# Altium schematic sheet PID.SchDoc: Constant tuning PID
size A2; Author: M.Beldyga; CompanyName: WUT ISE; DrawnBy: M.Beldyga; Organization: WUT ISE; Address1: PW ISE; Address2: Nowowiejska 15/19 00-665 Warsaw; Address3: micbeldyga@gmail.com; SheetNumber: 2; SheetTotal: 12; ModifiedBy: -; CheckedDate: -; DivGrp: WUT ISE; Designer: M.Beldyga; ModifiedDate: -; ProjectName: Sensor Box
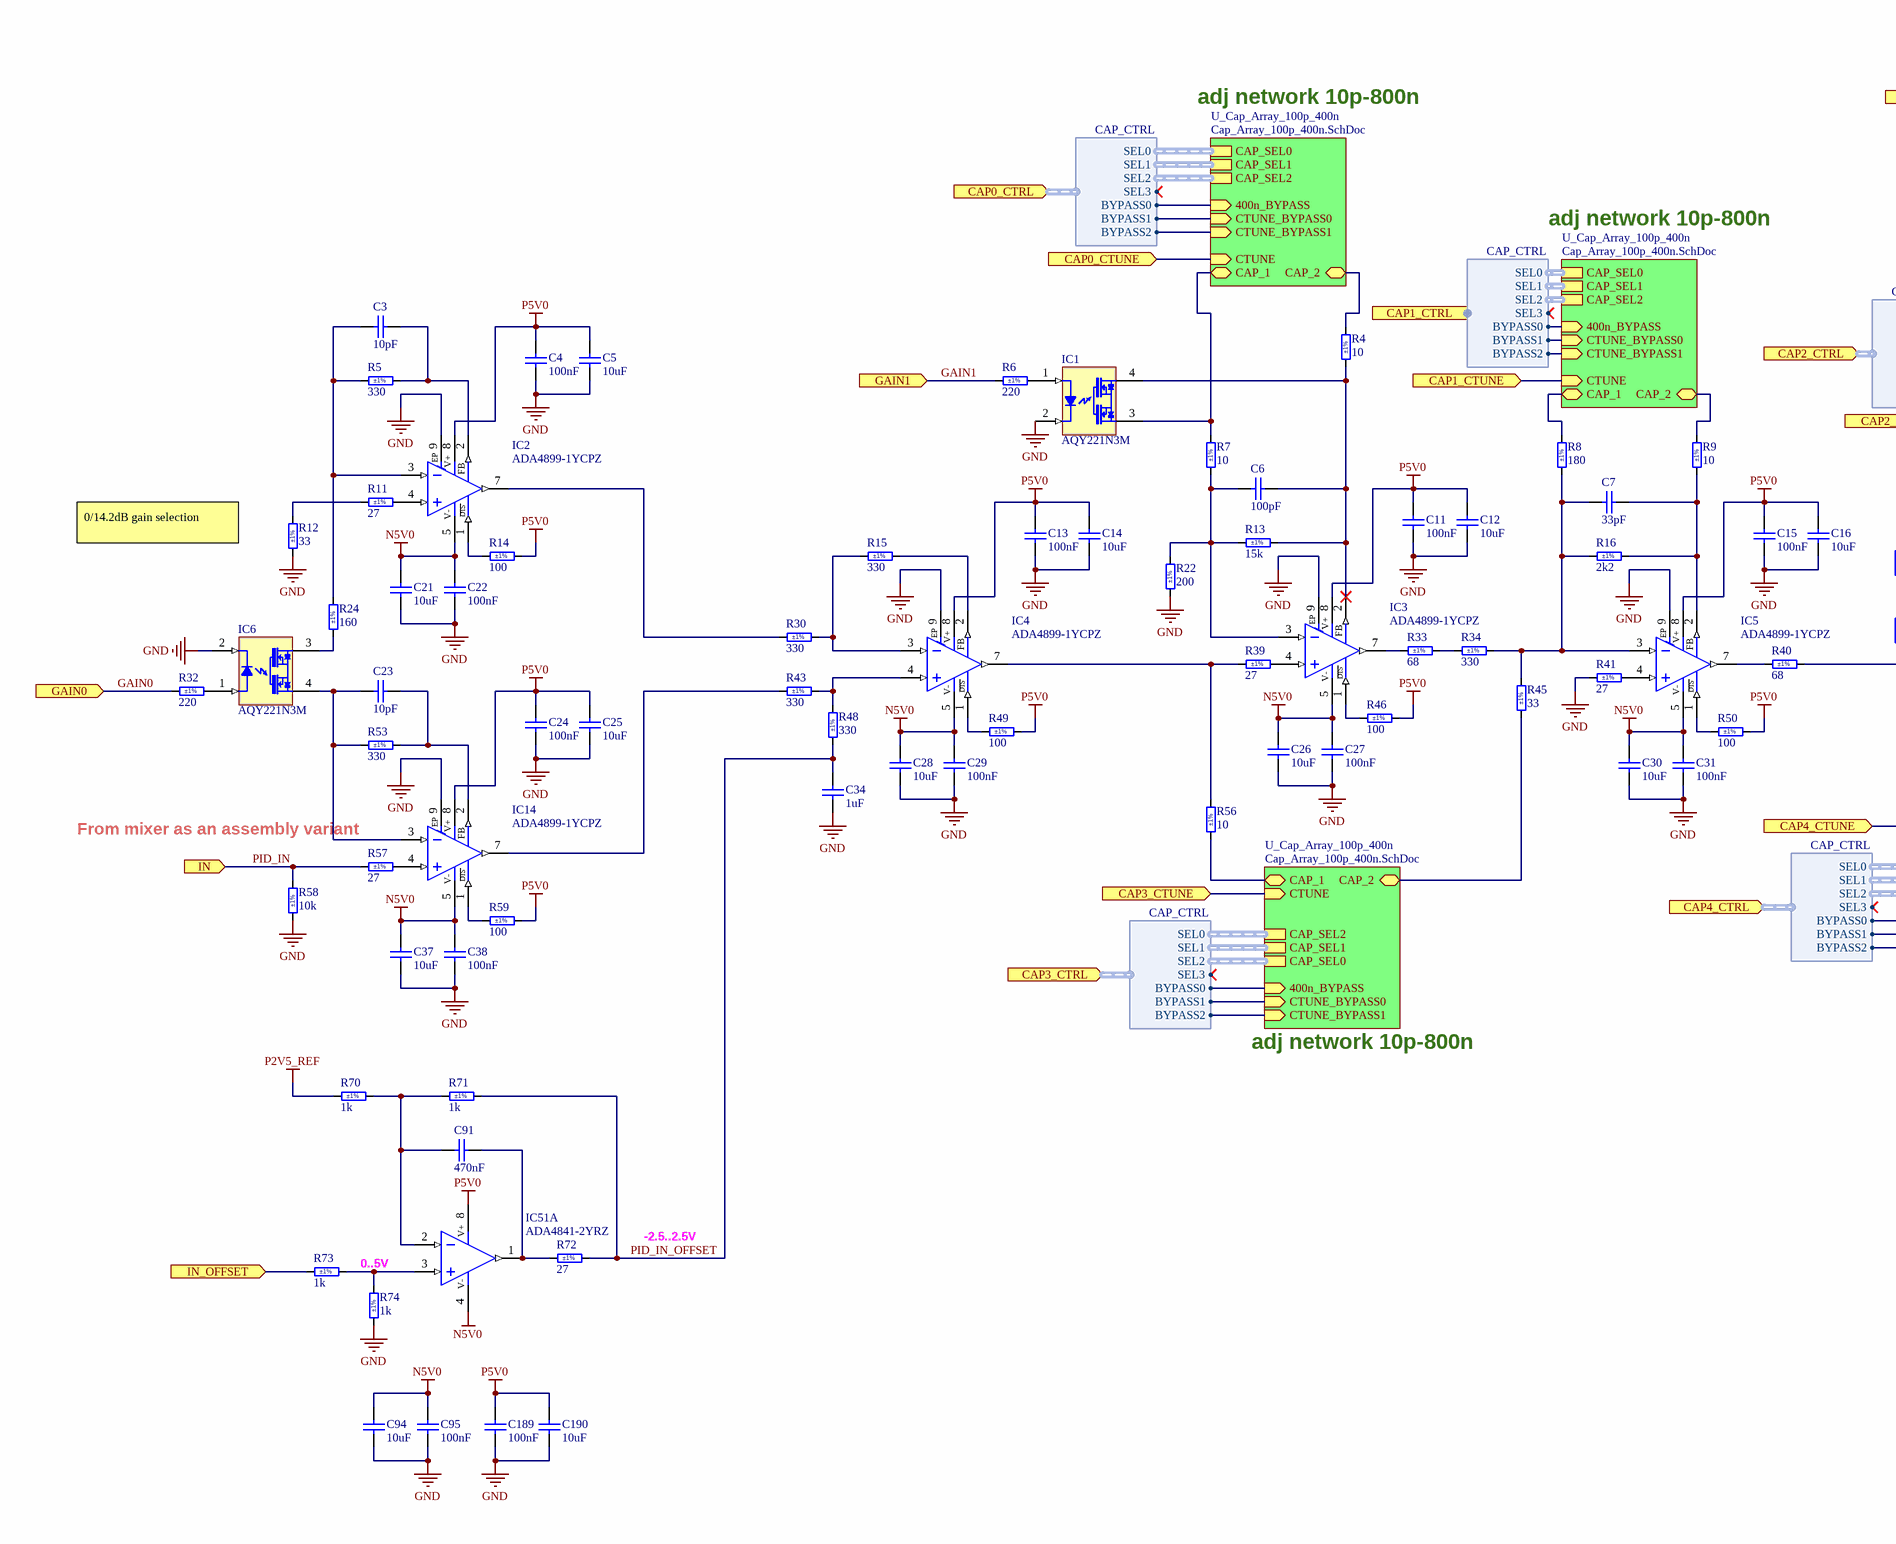
[diagram p0: PID.SchDoc, left]
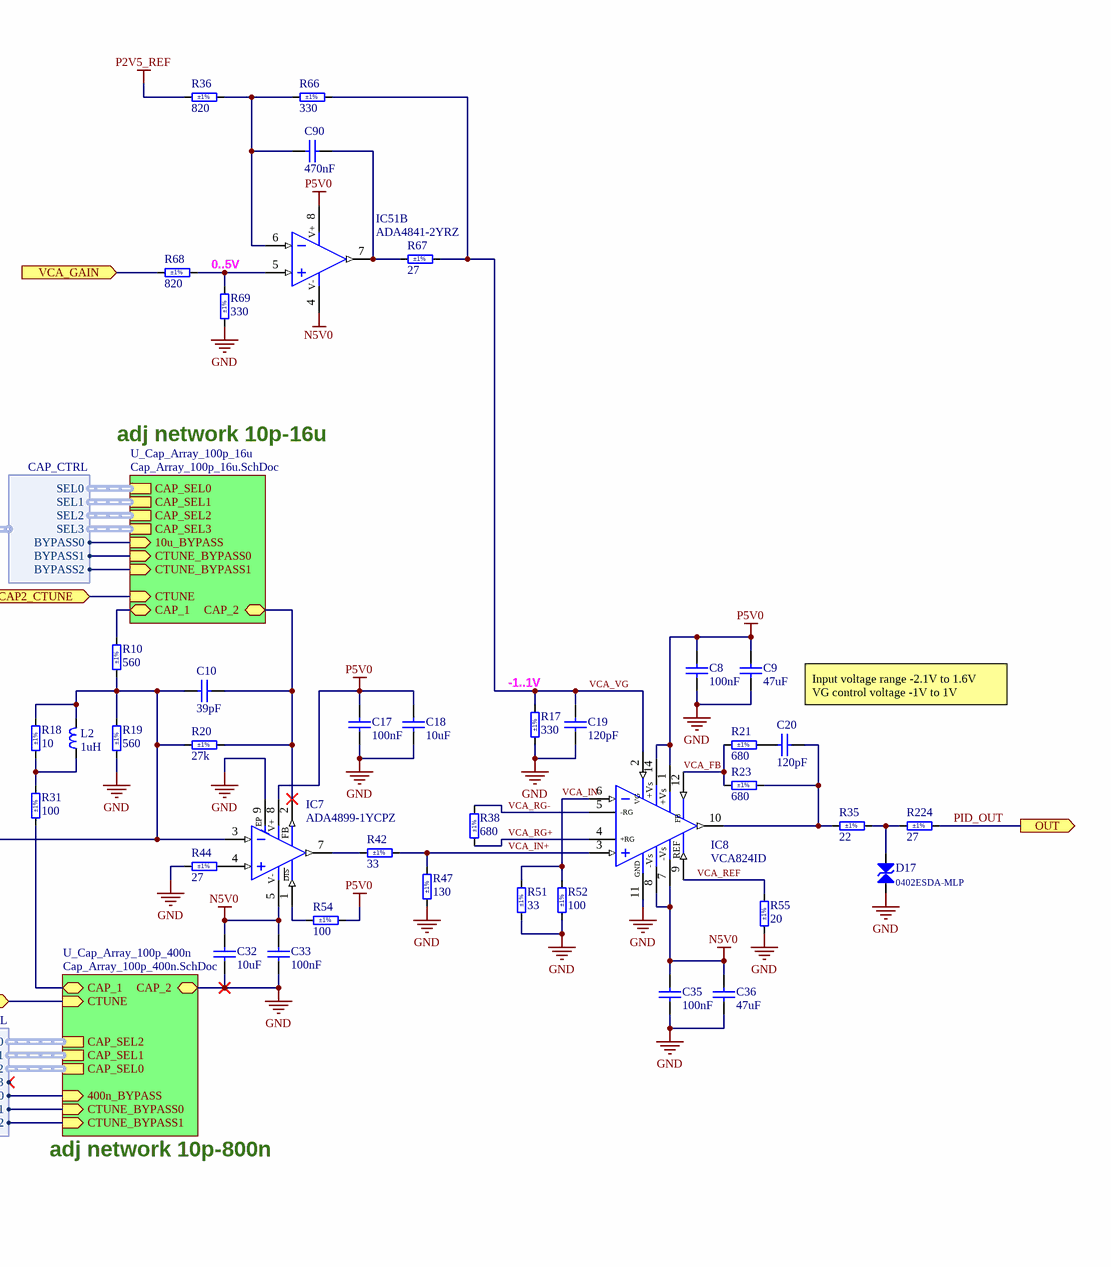
[diagram p1: PID.SchDoc, right]

## Parts
C3  10pF  [CAPC1005X55N]
C4  100nF  [CAPC1005X55N]
C5  10uF  [CAPC2012X95N]
C6  100pF  [CAPC1005X55N]
C7  33pF  [CAPC1005X55N]
C8  100nF  [CAPC1005X55N]
C9  47uF  [CAPC3216X180N]
C10  39pF  [CAPC1005X55N]
C11  100nF  [CAPC1005X55N]
C12  10uF  [CAPC2012X95N]
C13  100nF  [CAPC1005X55N]
C14  10uF  [CAPC2012X95N]
C15  100nF  [CAPC1005X55N]
C16  10uF  [CAPC2012X95N]
C17  100nF  [CAPC1005X55N]
C18  10uF  [CAPC2012X95N]
C19  120pF  [CAPC1005X55N]
C20  120pF  [CAPC1005X55N]
C21  10uF  [CAPC2012X95N]
C22  100nF  [CAPC1005X55N]
C23  10pF  [CAPC1005X55N]
C24  100nF  [CAPC1005X55N]
C25  10uF  [CAPC2012X95N]
C26  10uF  [CAPC2012X95N]
C27  100nF  [CAPC1005X55N]
C28  10uF  [CAPC2012X95N]
C29  100nF  [CAPC1005X55N]
C30  10uF  [CAPC2012X95N]
C31  100nF  [CAPC1005X55N]
C32  10uF  [CAPC2012X95N]
C33  100nF  [CAPC1005X55N]
C34  1uF  [CAPC1005X55N]
C35  100nF  [CAPC1005X55N]
C36  47uF  [CAPC3216X180N]
C37  10uF  [CAPC2012X95N]
C38  100nF  [CAPC1005X55N]
C90  470nF  [CAPC1005X55N]
C91  470nF  [CAPC1005X55N]
C94  10uF  [CAPC2012X95N]
C95  100nF  [CAPC1005X55N]
C189  100nF  [CAPC1005X55N]
C190  10uF  [CAPC2012X95N]
D17  0402ESDA-MLP  [EATON_0402ESDA-MLP]
IC1  AQY221N3M  [PANASONIC_AQY22(SON)]
IC2  ADA4899-1YCPZ  [SON50P300X300X90-9N-R160X189]
IC3  ADA4899-1YCPZ  [SON50P300X300X90-9N-R160X189]
IC4  ADA4899-1YCPZ  [SON50P300X300X90-9N-R160X189]
IC5  ADA4899-1YCPZ  [SON50P300X300X90-9N-R160X189]
IC6  AQY221N3M  [PANASONIC_AQY22(SON)]
IC7  ADA4899-1YCPZ  [SON50P300X300X90-9N-R160X189]
IC8  VCA824ID  [SOIC127P600X175-14N]
IC14  ADA4899-1YCPZ  [SON50P300X300X90-9N-R160X189]
IC51  ADA4841-2YRZ  [SOIC127P600X175-8N]  (parts A,B of 2)
L2  1uH  [INDC2113X60N]
R4  10  Tolerance: ±1%  [RESC1005X40N]
R5  330  Tolerance: ±1%  [RESC1005X40N]
R6  220  Tolerance: ±1%  [RESC1005X40N]
R7  10  Tolerance: ±1%  [RESC1005X40N]
R8  180  Tolerance: ±1%  [RESC1005X40N]
R9  10  Tolerance: ±1%  [RESC1005X40N]
R10  560  Tolerance: ±1%  [RESC1005X40N]
R11  27  Tolerance: ±1%  [RESC1005X40N]
R12  33  Tolerance: ±1%  [RESC1005X40N]
R13  15k  Tolerance: ±1%  [RESC1005X40N]
R14  100  Tolerance: ±1%  [RESC1005X40N]
R15  330  Tolerance: ±1%  [RESC1005X40N]
R16  2k2  Tolerance: ±1%  [RESC1005X40N]
R17  330  Tolerance: ±1%  [RESC1005X40N]
R18  10  Tolerance: ±1%  [RESC1005X40N]
R19  560  Tolerance: ±1%  [RESC1005X40N]
R20  27k  Tolerance: ±1%  [RESC1005X40N]
R21  680  Tolerance: ±1%  [RESC1005X40N]
R22  200  Tolerance: ±1%  [RESC1005X40N]
R23  680  Tolerance: ±1%  [RESC1005X40N]
R24  160  Tolerance: ±1%  [RESC1005X40N]
R30  330  Tolerance: ±1%  [RESC1005X40N]
R31  100  Tolerance: ±1%  [RESC1005X40N]
R32  220  Tolerance: ±1%  [RESC1005X40N]
R33  68  Tolerance: ±1%  [RESC1005X40N]
R34  330  Tolerance: ±1%  [RESC1005X40N]
R35  22  Tolerance: ±1%  [RESC2012X60N]
R36  820  Tolerance: ±1%  [RESC1005X40N]
R38  680  Tolerance: ±1%  [RESC1005X40N]
R39  27  Tolerance: ±1%  [RESC1005X40N]
R40  68  Tolerance: ±1%  [RESC1005X40N]
R41  27  Tolerance: ±1%  [RESC1005X40N]
R42  33  Tolerance: ±1%  [RESC1005X40N]
R43  330  Tolerance: ±1%  [RESC1005X40N]
R44  27  Tolerance: ±1%  [RESC1005X40N]
R45  33  Tolerance: ±1%  [RESC1005X40N]
R46  100  Tolerance: ±1%  [RESC1005X40N]
R47  130  Tolerance: ±1%  [RESC1005X40N]
R48  330  Tolerance: ±1%  [RESC1005X40N]
R49  100  Tolerance: ±1%  [RESC1005X40N]
R50  100  Tolerance: ±1%  [RESC1005X40N]
R51  33  Tolerance: ±1%  [RESC1005X40N]
R52  100  Tolerance: ±1%  [RESC1005X40N]
R53  330  Tolerance: ±1%  [RESC1005X40N]
R54  100  Tolerance: ±1%  [RESC1005X40N]
R55  20  Tolerance: ±1%  [RESC1005X40N]
R56  10  Tolerance: ±1%  [RESC1005X40N]
R57  27  Tolerance: ±1%  [RESC1005X40N]
R58  10k  Tolerance: ±1%  [RESC1005X40N]
R59  100  Tolerance: ±1%  [RESC1005X40N]
R66  330  Tolerance: ±1%  [RESC1005X40N]
R67  27  Tolerance: ±1%  [RESC1005X40N]
R68  820  Tolerance: ±1%  [RESC1005X40N]
R69  330  Tolerance: ±1%  [RESC1005X40N]
R70  1k  Tolerance: ±1%  [RESC1005X40N]
R71  1k  Tolerance: ±1%  [RESC1005X40N]
R72  27  Tolerance: ±1%  [RESC1005X40N]
R73  1k  Tolerance: ±1%  [RESC1005X40N]
R74  1k  Tolerance: ±1%  [RESC1005X40N]
R224  27  Tolerance: ±1%  [RESC2012X60N]

## Sub-sheets
U_Cap_Array_100p_16u = Cap_Array_100p_16u.SchDoc: CAP_1 (bidir), CAP_2 (bidir), CTUNE_BYPASS0 (in), CTUNE (in), 10u_BYPASS (in), CAP_SEL0 (harness CAP_SEL), CAP_SEL1 (harness CAP_SEL), CAP_SEL2 (harness CAP_SEL), CAP_SEL3 (harness CAP_SEL), CTUNE_BYPASS1 (in)
U_Cap_Array_100p_400n = Cap_Array_100p_400n.SchDoc: CAP_1 (bidir), CAP_2 (bidir), CTUNE_BYPASS0 (in), 400n_BYPASS (in), CTUNE (in), CAP_SEL0 (harness CAP_SEL), CAP_SEL1 (harness CAP_SEL), CAP_SEL2 (harness CAP_SEL), CTUNE_BYPASS1 (in)
U_Cap_Array_100p_400n = Cap_Array_100p_400n.SchDoc: CAP_1 (bidir), CAP_2 (bidir), CTUNE_BYPASS0 (in), 400n_BYPASS (in), CTUNE (in), CAP_SEL0 (harness CAP_SEL), CAP_SEL1 (harness CAP_SEL), CAP_SEL2 (harness CAP_SEL), CTUNE_BYPASS1 (in)
U_Cap_Array_100p_400n = Cap_Array_100p_400n.SchDoc: CAP_1 (bidir), CAP_2 (bidir), CTUNE_BYPASS0 (in), 400n_BYPASS (in), CTUNE (in), CAP_SEL0 (harness CAP_SEL), CAP_SEL1 (harness CAP_SEL), CAP_SEL2 (harness CAP_SEL), CTUNE_BYPASS1 (in)
U_Cap_Array_100p_400n = Cap_Array_100p_400n.SchDoc: CAP_1 (bidir), CAP_2 (bidir), CTUNE_BYPASS0 (in), 400n_BYPASS (in), CTUNE (in), CAP_SEL0 (harness CAP_SEL), CAP_SEL1 (harness CAP_SEL), CAP_SEL2 (harness CAP_SEL), CTUNE_BYPASS1 (in)

## Ports
CAP0_CTRL (in, harness CAP_CTRL), CAP0_CTUNE (in), CAP1_CTRL (in, harness CAP_ctrl), CAP1_CTUNE (in), CAP2_CTRL (in, harness CAP_ctrl), CAP2_CTUNE (in), CAP3_CTRL (in, harness CAP_CTRL), CAP3_CTUNE (in), CAP4_CTRL (in, harness CAP_CTRL), CAP4_CTUNE (in), GAIN0 (in), GAIN1 (in), IN (in), IN_OFFSET (in), OUT (out), VCA_GAIN (in)

## Harnesses
CAP_CTRL: BYPASS0, BYPASS1, SEL0, SEL1, SEL2, SEL3, BYPASS2

## Nets
GND: C4.1 C5.1 C8.1 C9.1 C11.1 C12.1 C13.1 C14.1 C15.1 C16.1 C17.1 C18.1 C19.2 C21.1 C22.1 C24.1 C25.1 C26.1 C27.1 C28.1 C29.1 C30.1 C31.1 C32.1 C33.1 C34.1 C35.1 C36.1 C37.1 C38.1 C94.1 C95.1 C189.1 C190.1 D17.1 IC1.2(K) IC2.9(EP) IC3.9(EP) IC4.9(EP) IC5.9(EP) IC6.2(K) IC7.9(EP) IC8.11(GND) IC14.9(EP) R12.1 R17.1 R19.1 R22.1 R41.1 R44.1 R47.1 R51.1 R52.1 R55.2 R58.1 R69.1 R74.1 ; sheet U_Cap_Array_100p_400n/CAP_2
N5V0: C21.2 C22.2 C26.2 C27.2 C28.2 C29.2 C30.2 C31.2 C32.2 C33.2 C35.2 C36.2 C37.2 C38.2 C94.2 C95.2 IC2.5(V-) IC3.5(V-) IC4.5(V-) IC5.5(V-) IC7.5(V-) IC8.7(-Vs) IC8.8(-Vs) IC14.5(V-) IC51.4(V-)
P2V5_REF: R36.1 R70.1
P5V0: C4.2 C5.2 C8.2 C9.2 C11.2 C12.2 C13.2 C14.2 C15.2 C16.2 C17.2 C18.2 C24.2 C25.2 C189.2 C190.2 IC2.8(V+) IC3.8(V+) IC4.8(V+) IC5.8(V+) IC7.8(V+) IC8.1(+Vs) IC8.14(+Vs) IC14.8(V+) IC51.8(V+) R14.2 R46.2 R49.2 R50.2 R54.2 R59.2
CAP0_CTUNE: port CAP0_CTUNE, sheet U_Cap_Array_100p_400n/CTUNE
CAP1_CTUNE: port CAP1_CTUNE, sheet U_Cap_Array_100p_400n/CTUNE
CAP2_CTUNE: port CAP2_CTUNE, sheet U_Cap_Array_100p_16u/CTUNE
CAP3_CTUNE: port CAP3_CTUNE, sheet U_Cap_Array_100p_400n/CTUNE
CAP4_CTUNE: port CAP4_CTUNE, sheet U_Cap_Array_100p_400n/CTUNE
GAIN0: R32.1 ; port GAIN0
GAIN1: R6.1 ; port GAIN1
IN_OFFSET: R73.1 ; port IN_OFFSET
PID_IN: R57.1 R58.2 ; port IN
PID_IN_OFFSET: C34.2 R48.1 R71.2 R72.2
PID_OUT: R224.2 ; port OUT
VCA_FB: IC8.12(FB) R21.1 R23.1
VCA_GAIN: R68.1 ; port VCA_GAIN
VCA_IN+: IC8.3(+IN) R42.1 R47.2
VCA_IN-: IC8.6(-IN) R51.2 R52.2
VCA_REF: IC8.9(REF) R55.1
VCA_RG+: IC8.4(+RG) R38.2
VCA_RG-: IC8.5(-RG) R38.1
VCA_VG: C19.1 IC8.2(VG) R17.2 R66.2 R67.2
NetC3_1: C3.1 IC2.3(IN-) R5.1 R24.2
NetC3_2: C3.2 IC2.2(FB) R5.2
NetC6_1: C6.1 IC3.3(IN-) R7.1 R13.1 R22.2
NetC6_2: C6.2 IC1.4(E) IC3.2(FB) R4.1 R13.2
NetC7_1: C7.1 IC5.3(IN-) R8.1 R16.1 R34.2 R45.2
NetC7_2: C7.2 IC5.2(FB) R9.1 R16.2
NetC10_1: C10.1 IC7.3(IN-) L2.2 R10.2 R18.2 R19.2 R20.1 R40.2
NetC10_2: C10.2 IC7.2(FB) R20.2 ; sheet U_Cap_Array_100p_16u/CAP_2
NetC20_1: C20.1 IC8.10(Vout) R23.2 R35.1
NetC20_2: C20.2 R21.2
NetC23_1: C23.1 IC6.4(E) IC14.3(IN-) R53.1
NetC23_2: C23.2 IC14.2(FB) R53.2
NetC90_1: C90.1 IC51.6(IN-) R36.2 R66.1
NetC90_2: C90.2 IC51.7(OUT) R67.1
NetC91_1: C91.1 IC51.2(IN-) R70.2 R71.1
NetC91_2: C91.2 IC51.1(OUT) R72.1
NetD17_2: D17.2 R35.2 R224.1
NetIC1_1: IC1.1(A) R6.2
NetIC1_3: IC1.3(C) R7.2 ; sheet U_Cap_Array_100p_400n/CAP_1
NetIC2_1: IC2.1(~{DIS}) R14.1
NetIC2_4: IC2.4(IN+) R11.2
NetIC2_7: IC2.7(OUT) R30.1
NetIC3_1: IC3.1(~{DIS}) R46.1
NetIC3_4: IC3.4(IN+) R39.2
NetIC3_7: IC3.7(OUT) R33.1
NetIC4_1: IC4.1(~{DIS}) R49.1
NetIC4_2: IC4.2(FB) R15.2
NetIC4_3: IC4.3(IN-) R15.1 R30.2
NetIC4_4: IC4.4(IN+) R43.2 R48.2
NetIC4_7: IC4.7(OUT) R39.1 R56.2
NetIC5_1: IC5.1(~{DIS}) R50.1
NetIC5_4: IC5.4(IN+) R41.2
NetIC5_7: IC5.7(OUT) R40.1
NetIC6_1: IC6.1(A) R32.2
NetIC6_3: IC6.3(C) R24.1
NetIC7_1: IC7.1(~{DIS}) R54.1
NetIC7_4: IC7.4(IN+) R44.2
NetIC7_7: IC7.7(OUT) R42.2
NetIC14_1: IC14.1(~{DIS}) R59.1
NetIC14_4: IC14.4(IN+) R57.2
NetIC14_7: IC14.7(OUT) R43.1
NetIC51_3: IC51.3(IN+) R73.2 R74.2
NetIC51_5: IC51.5(IN+) R68.2 R69.2
NetL2_1: L2.1 R18.1 R31.2
NetR4_2: R4.2 ; sheet U_Cap_Array_100p_400n/CAP_2
NetR8_2: R8.2 ; sheet U_Cap_Array_100p_400n/CAP_1
NetR9_2: R9.2 ; sheet U_Cap_Array_100p_400n/CAP_2
NetR10_1: R10.1 ; sheet U_Cap_Array_100p_16u/CAP_1
NetR11_1: R11.1 R12.2
NetR31_1: R31.1 ; sheet U_Cap_Array_100p_400n/CAP_1
NetR33_2: R33.2 R34.1
NetR45_1: R45.1 ; sheet U_Cap_Array_100p_400n/CAP_2
NetR56_1: R56.1 ; sheet U_Cap_Array_100p_400n/CAP_1
(unnamed): sheet U_Cap_Array_100p_400n/CTUNE_BYPASS0, port CAP1_CTRL.BYPASS1
(unnamed): sheet U_Cap_Array_100p_400n/400n_BYPASS, port CAP1_CTRL.BYPASS0
(unnamed): sheet U_Cap_Array_100p_400n/CTUNE_BYPASS1, port CAP1_CTRL.BYPASS2
(unnamed): sheet U_Cap_Array_100p_400n/CTUNE_BYPASS0, port CAP0_CTRL.BYPASS1
(unnamed): sheet U_Cap_Array_100p_400n/400n_BYPASS, port CAP0_CTRL.BYPASS0
(unnamed): sheet U_Cap_Array_100p_400n/CTUNE_BYPASS1, port CAP0_CTRL.BYPASS2
(unnamed): sheet U_Cap_Array_100p_400n/CTUNE_BYPASS0, port CAP3_CTRL.BYPASS1
(unnamed): sheet U_Cap_Array_100p_400n/400n_BYPASS, port CAP3_CTRL.BYPASS0
(unnamed): sheet U_Cap_Array_100p_400n/CTUNE_BYPASS1, port CAP3_CTRL.BYPASS2
(unnamed): sheet U_Cap_Array_100p_400n/CTUNE_BYPASS0, port CAP4_CTRL.BYPASS1
(unnamed): sheet U_Cap_Array_100p_400n/400n_BYPASS, port CAP4_CTRL.BYPASS0
(unnamed): sheet U_Cap_Array_100p_400n/CTUNE_BYPASS1, port CAP4_CTRL.BYPASS2
(unnamed): sheet U_Cap_Array_100p_16u/CTUNE_BYPASS0, port CAP2_CTRL.BYPASS1
(unnamed): sheet U_Cap_Array_100p_16u/10u_BYPASS, port CAP2_CTRL.BYPASS0
(unnamed): sheet U_Cap_Array_100p_16u/CTUNE_BYPASS1, port CAP2_CTRL.BYPASS2

## Notes on the sheet
- adj network 10p-800n
- 0..5V
- adj network 10p-16u
- 0/14.2dB gain selection
- (near R17) -1..1V
- Input voltage range -2.1V to 1.6V
  VG control voltage -1V to 1V
- (near R57) From mixer as an assembly variant
- -2.5..2.5V
- Project/Equipment
- Document
- Designer
- Drawn by
- Check.by
- Last Mod.
- Contact
- File
- Print Date
- Sheet
- Size
- A2
- of
- Rev
- (in symbol ADA4899-1YCPZ) DIS

## Library data of the parts
C3 C23 = CC0402_10PF_50V_5%_C0G: Non-polarised capacitor; Part Description: SMD Multilayer Chip Ceramic Capacitor; Manufacturer: GENERIC; Manufacturer1 Part Number: C0402C100J5GACTU; Voltage: 50V; TC: C0G/NP0; Tolerance: ±5%; Part Number: CC0402_10PF_50V_5%_C0G; Component Kind: Standard; Component Type: Standard; Pin Count: 2; Value: 10pF; Status: Preferred; Manufacturer Part Number: CC0402_10PF_50V_5%_C0G; Case: 0402; Mounted: Yes; Socket: No; SMD: Yes; Sense: No; Manufacturer1 Example: KEMET; Manufacturer1 ComponentHeight: 0.55mm; HelpURL: \\cern.ch\dfs\Applications\Altium\Datasheets\CC0402_C0G_KEMET_(Commercial Grade).pdf; Author: CERN DEM JLC; CreateDate: 12/3/2007; LatestRevisionDate: 4/22/2015
C4 C8 C11 C13 C15 C17 C22 C24 C27 C29 C31 C33 C35 C38 C95 C189 = CC0402_100NF_50V_10%_X7R: Non-polarised capacitor; Part Description: SMD Multilayer Chip Ceramic Capacitor; Manufacturer: GENERIC; Manufacturer1 Part Number: GRM155R71H104KE14D; Voltage: 50V; TC: X7R; Tolerance: ±10%; Part Number: CC0402_100NF_50V_10%_X7R; Component Kind: Standard; Component Type: Standard; Pin Count: 2; Value: 100nF; Status: None; Manufacturer Part Number: CC0402_100NF_50V_10%_X7R; Case: 0402; Mounted: Yes; Socket: No; SMD: Yes; Sense: No; Manufacturer1 Example: MURATA; Manufacturer1 ComponentHeight: 0.55mm; HelpURL: \\cern.ch\dfs\Applications\Altium\Datasheets\CC0402_MURATA_GRM155R71H104KE14D.pdf; Author: CERN DEM MR; CreateDate: 6/30/2017; LatestRevisionDate: 6/30/2017
C5 C12 C14 C16 C18 C21 C25 C26 C28 C30 C32 C37 C94 C190 = CC0805_10UF_25V_10%_X5R: Non-polarised capacitor; Part Description: SMD Multilayer Chip Ceramic Capacitor; Manufacturer: GENERIC; Manufacturer1 Part Number: GRM219R61E106KA12D; Voltage: 25V; TC: X5R; Tolerance: ±10%; Part Number: CC0805_10UF_25V_10%_X5R; Component Kind: Standard; Component Type: Standard; Pin Count: 2; Value: 10uF; Status: Preferred; Manufacturer Part Number: CC0805_10UF_25V_10%_X5R; Case: 0805; Mounted: Yes; Socket: No; SMD: Yes; Sense: No; Manufacturer1 Example: MURATA; Manufacturer1 ComponentHeight: 0.95mm; HelpURL: \\cern.ch\dfs\Applications\Altium\Datasheets\CC0805_X5R_MURATA_GRM.pdf; Author: CERN DEM JLC; CreateDate: 10/25/2012; LatestRevisionDate: 9/6/2016
C6 = CC0402_100PF_50V_5%_C0G: Non-polarised capacitor; Part Description: SMD Multilayer Chip Ceramic Capacitor; Manufacturer: GENERIC; Manufacturer1 Part Number: C0402C101J5GACTU; Voltage: 50V; TC: C0G/NP0; Tolerance: ±5%; Part Number: CC0402_100PF_50V_5%_C0G; Component Kind: Standard; Component Type: Standard; Pin Count: 2; Value: 100pF; Status: Preferred; Manufacturer Part Number: CC0402_100PF_50V_5%_C0G; Case: 0402; Mounted: Yes; Socket: No; SMD: Yes; Sense: No; Manufacturer1 Example: KEMET; Manufacturer1 ComponentHeight: 0.55mm; HelpURL: \\cern.ch\dfs\Applications\Altium\Datasheets\CC0402_C0G_KEMET_(Commercial Grade).pdf; Author: CERN DEM JLC; CreateDate: 12/3/2007; LatestRevisionDate: 4/22/2015
C7 = CC0402_33PF_50V_5%_C0G: Non-polarised capacitor; Part Description: SMD Multilayer Chip Ceramic Capacitor; Manufacturer: GENERIC; Manufacturer1 Part Number: C0402C330J5GACTU; Voltage: 50V; TC: C0G/NP0; Tolerance: ±5%; Part Number: CC0402_33PF_50V_5%_C0G; Component Kind: Standard; Component Type: Standard; Pin Count: 2; Value: 33pF; Status: Preferred; Manufacturer Part Number: CC0402_33PF_50V_5%_C0G; Case: 0402; Mounted: Yes; Socket: No; SMD: Yes; Sense: No; Manufacturer1 Example: KEMET; Manufacturer1 ComponentHeight: 0.55mm; HelpURL: \\cern.ch\dfs\Applications\Altium\Datasheets\CC0402_C0G_KEMET_(Commercial Grade).pdf; Author: CERN DEM JLC; CreateDate: 12/3/2007; LatestRevisionDate: 4/22/2015
C9 C36 = CC1206_47UF_25V_20%_X5R: Non-polarised capacitor; Part Description: SMD Multilayer Chip Ceramic Capacitor; Manufacturer: GENERIC; Manufacturer1 Part Number: C3216X5R1E476M160; Voltage: 25V; TC: X5R; Tolerance: ±20%; Part Number: CC1206_47UF_25V_20%_X5R; Component Kind: Standard; Component Type: Standard; Pin Count: 2; Value: 47uF; Status: None; Manufacturer Part Number: CC1206_47UF_25V_20%_X5R; Case: 1206; Mounted: Yes; Socket: No; SMD: Yes; Sense: No; Manufacturer1 Example: TDK; Manufacturer1 ComponentHeight: 1.8mm; HelpURL: \\cern.ch\dfs\Applications\Altium\Datasheets\CC1206_X5R_TDK_C.pdf; Author: CERN DEM JLC; CreateDate: 11/20/2013; LatestRevisionDate: 3/14/2017
C10 = CC0402_39PF_100V_5%_C0G_MURATA_GRM1555C2A390JA01: Non-polarised capacitor; Part Description: Chip Multilayer Ceramic Capacitor for General Purpose; Manufacturer: MURATA; Voltage: 100V; TC: C0G/NP0; Tolerance: ±5%; Part Number: CC0402_39PF_100V_5%_C0G_MURATA_GRM1555C2A390JA01; Component Kind: Standard; Component Type: Standard; Pin Count: 2; Value: 39pF; Status: None; Manufacturer Part Number: GRM1555C2A390JA01; Case: 0402; Mounted: Yes; Socket: No; SMD: Yes; Sense: No; ComponentHeight: 0.55mm; HelpURL: \\cern.ch\dfs\Applications\Altium\Datasheets\CC0402_MURATA_GRM1555C2A390JA01.pdf; Author: CERN DEM BC; CreateDate: 9/1/2020; LatestRevisionDate: 9/1/2020
C19 C20 = CC0402_120PF_50V_5%_C0G: Non-polarised capacitor; Part Description: SMD Multilayer Chip Ceramic Capacitor; Manufacturer: GENERIC; Manufacturer1 Part Number: C0402C121J5GACTU; Voltage: 50V; TC: C0G/NP0; Tolerance: ±5%; Part Number: CC0402_120PF_50V_5%_C0G; Component Kind: Standard; Component Type: Standard; Pin Count: 2; Value: 120pF; Status: Preferred; Manufacturer Part Number: CC0402_120PF_50V_5%_C0G; Case: 0402; Mounted: Yes; Socket: No; SMD: Yes; Sense: No; Manufacturer1 Example: KEMET; Manufacturer1 ComponentHeight: 0.55mm; HelpURL: \\cern.ch\dfs\Applications\Altium\Datasheets\CC0402_C0G_KEMET_(Commercial Grade).pdf; Author: CERN DEM JLC; CreateDate: 11/10/2011; LatestRevisionDate: 4/22/2015
C34 = CC0402_1UF_16V_10%_X5R: Non-polarised capacitor; Part Description: SMD Multilayer Chip Ceramic Capacitor; Manufacturer: GENERIC; Manufacturer1 Part Number: C1005X5R1C105KT; Voltage: 16V; TC: X5R; Tolerance: ±10%; Part Number: CC0402_1UF_16V_10%_X5R; Component Kind: Standard; Component Type: Standard; Pin Count: 2; Value: 1uF; Status: Preferred; Manufacturer Part Number: CC0402_1UF_16V_10%_X5R; Case: 0402; Mounted: Yes; Socket: No; SMD: Yes; Sense: No; Manufacturer1 Example: TDK; Manufacturer1 ComponentHeight: 0.55mm; HelpURL: \\cern.ch\dfs\Applications\Altium\Datasheets\CC0402_X5R_TDK_C.pdf; Author: CERN DEM JLC; CreateDate: 10/25/2012; LatestRevisionDate: 10/25/2012
C90 C91 = CC0402_470NF_16V_10%_X5R: Non-polarised capacitor; Part Description: SMD Multilayer Chip Ceramic Capacitor; Manufacturer: GENERIC; Manufacturer1 Part Number: C1005X5R1C105KT; Voltage: 16V; TC: X5R; Tolerance: ±10%; Part Number: CC0402_470NF_16V_10%_X5R; Component Kind: Standard; Component Type: Standard; Pin Count: 2; Value: 470nF; Status: Preferred; Manufacturer Part Number: CC0402_470NF_16V_10%_X5R; Case: 0402; Mounted: Yes; Socket: No; SMD: Yes; Sense: No; Manufacturer1 Example: TDK; Manufacturer1 ComponentHeight: 0.55mm; HelpURL: \\cern.ch\dfs\Applications\Altium\Datasheets\CC0402_X5R_TDK_C.pdf; Author: CERN DEM JLC; CreateDate: 10/25/2012; LatestRevisionDate: 10/25/2012
D17 = 0402ESDA-MLP: Transient Voltage Suppressor Diode (Bi-Directional); Part Description: 0.05pF 8kV Bidirectional ESD Voltage Suppressor; Manufacturer: EATON; Voltage: 8kV; PressFit: No; Bonding: No; Part Number: 0402ESDA-MLP; Component Kind: Standard; Component Type: Standard; Device: 0402ESDA-MLP; PackageDescription: 0402, 2-Leads, Body 1.1mm L X 0.53mm W X 0.44mm H body, IPC Medium Density; Manufacturer Part Number: 0402ESDA-MLP; Pin Count: 2; Case: 0402; Mounted: Yes; Socket: No; SMD: Yes; Sense: No; ComponentHeight: 0.44mm; HelpURL: \\cern.ch\dfs\Applications\Altium\Datasheets\0402ESDA-MLP.pdf; Author: CERN DEM MR; CreateDate: 11/22/2019; LatestRevisionDate: 11/22/2019
IC1 IC6 = AQY221N3M: PhotoMOS Relay; Part Description: RF SON 1 Form A, PhotoMOS Relay, CxR5 (On Res. 5.5Ohm, Out Cap. 1.1pF), 25V 150mA; Manufacturer: PANASONIC; PressFit: No; Bonding: No; Part Number: AQY221N3M; Component Kind: Standard; Component Type: Standard; Device: AQY221N3M; PackageDescription: PANASONIC Serie AQY22(SON), 1.27mm Pitch; 4 Pin, 2.95mm W X 2.20mm L X 1.60mm H body; Manufacturer Part Number: AQY221N3M; Pin Count: 4; Case: SON4; Mounted: Yes; Socket: No; SMD: Yes; Sense: No; ComponentHeight: 1.4mm; HelpURL: \\cern.ch\dfs\Applications\Altium\Datasheets\AQY221N3M.pdf; ComponentLink1Description: Package Drawing; ComponentLink1URL: \\cern.ch\dfs\Applications\Altium\Datasheets\AQY22_Package-Drawing.pdf; Author: CERN DEM JLC; CreateDate: 1/18/2010; LatestRevisionDate: 12/5/2018
IC2-IC5 IC7 IC14 = ADA4899-1YCPZ: Unity-Gain Stable, Ultralow Distortion, 1 nV/sqrt Hz Voltage Noise, High Speed Operational Amplifier; Manufacturer: ANALOG DEVICES; PressFit: No; Bonding: No; Part Number: ADA4899-1YCPZ; Component Kind: Standard; Component Type: Standard; Device: ADA4899-1YCPZ; PackageDescription: SON (DFN), 0.50mm Pitch; 8 Pin, 3.00mm W X 3.00mm L X 0.90mm H body (w/Thermal Tab 1.60 X 1.89mm), IPC Medium Density; Part Description: Unity-Gain Stable, Ultralow Distortion, 1nV/sqrt Hz Voltage Noise, High Speed Operational Amplifier; Manufacturer Part Number: ADA4899-1YCP; Pin Count: 8; Case: SON8; Mounted: Yes; Socket: No; SMD: Yes; Sense: No; ComponentHeight: 0.9mm; Author: CERN DEM JLC; HelpURL: \\cern.ch\dfs\Applications\Altium\Datasheets\ADA4899-1YCPZ.pdf; CreateDate: 1/13/2010; LatestRevisionDate: 3/31/2022
IC8 = VCA824ID: Ultra-Wideband, > 40-dB Gain Adjust Range, Linear in V/V Variable Gain Amplifier; Manufacturer: TEXAS INSTRUMENTS; PressFit: No; Bonding: No; Part Number: VCA824ID; Component Kind: Standard; Component Type: Standard; Device: VCA824ID; PackageDescription: SOIC 14, Pitch 1.27mm - Body 4x8.75mm, IPC Medium Density; Part Description: Ultra-Wideband, > 40-dB Gain Adjust Range, Linear in V/V Variable Gain Amplifier; Manufacturer Part Number: VCA824ID; Pin Count: 14; Case: SOIC14; Mounted: Yes; Socket: No; SMD: Yes; Sense: No; ComponentHeight: 1.75mm; Author: CERN DEM HF; HelpURL: \\cern.ch\dfs\Applications\Altium\Datasheets\VCA824.pdf; CreateDate: 9/22/2022; LatestRevisionDate: 9/22/2022
IC51 = ADA4841-2YRZ: Dual Operational Amplifier; Part Description: Dual Low Power, Low Noise and Distortion, Rail-to-Rail Output Amplifier; Manufacturer: ANALOG DEVICES; PressFit: No; Bonding: No; Part Number: ADA4841-2YRZ; Component Kind: Standard; Component Type: Standard; Device: ADA4841-2YRZ; PackageDescription: SOIC 8, Pitch 1.27mm - Body 4x5mm, IPC Medium Density; Manufacturer Part Number: ADA4841-2YR; Pin Count: 8; Case: SOIC8; Mounted: Yes; Socket: No; SMD: Yes; Sense: No; ComponentHeight: 1.75mm; Author: CERN DEM JLC; HelpURL: \\cern.ch\dfs\Applications\Altium\Datasheets\ADA4841-2YRZ.pdf; CreateDate: 5/12/2011; LatestRevisionDate: 3/31/2022
L2 = IND0805_1UH_20%_WURTH_74479773210: Inductor; Part Description: Power Multilayer Inductor (WE-PMI Series); Manufacturer: WURTH ELEKTRONIK; Power: 800mA; Resistance: 0.18R; Tolerance: ±20%; Part Number: IND0805_1UH_20%_WURTH_74479773210; Component Kind: Standard; Component Type: Standard; Pin Count: 2; Value: 1uH; Manufacturer Part Number: 74479773210; Case: 0805; Mounted: Yes; Socket: No; SMD: Yes; Sense: No; ComponentHeight: 0.6mm; HelpURL: \\cern.ch\dfs\Applications\Altium\Datasheets\IND_WURTH_WE-PMI_74479773210.pdf; Author: CERN DEM BC; CreateDate: 8/26/2019; LatestRevisionDate: 8/26/2019
R4 R7 R9 R18 R56 = R0402_10R_1%_0.0625W_200PPM: Resistor - 1%; Part Description: General Purpose Thick Film Chip Resistor; Manufacturer: GENERIC; Manufacturer1 Part Number: 232270671009L; TC: ±200ppm/°C; PressFit: No; Part Number: R0402_10R_1%_0.0625W_200PPM; Component Kind: Standard; Component Type: Standard; Pin Count: 2; Value: 10; Status: Not Recommended; Power: 0.0625W; Manufacturer Part Number: R0402_10R_1%_0.0625W_200PPM; Case: 0402; Mounted: Yes; Sense: No; Socket: No; SMD: Yes; Manufacturer1 Example: YAGEO PHYCOMP; Manufacturer1 ComponentHeight: 0.4mm; HelpURL: \\cern.ch\dfs\Applications\Altium\Datasheets\R0402_Phycomp_RC0402.pdf; Author: CERN DEM JLC; CreateDate: 6/24/2009; LatestRevisionDate: 10/17/2012
R5 R15 R17 R30 R34 R43 R48 R53 R66 R69 = R0402_330R_1%_0.0625W_100PPM: Resistor - 1%; Part Description: General Purpose Thick Film Chip Resistor; Manufacturer: GENERIC; Manufacturer1 Part Number: 232270673301L; TC: ±100ppm/°C; PressFit: No; Part Number: R0402_330R_1%_0.0625W_100PPM; Component Kind: Standard; Component Type: Standard; Pin Count: 2; Value: 330; Status: Not Recommended; Power: 0.0625W; Manufacturer Part Number: R0402_330R_1%_0.0625W_100PPM; Case: 0402; Mounted: Yes; Sense: No; Socket: No; SMD: Yes; Manufacturer1 Example: YAGEO PHYCOMP; Manufacturer1 ComponentHeight: 0.4mm; HelpURL: \\cern.ch\dfs\Applications\Altium\Datasheets\R0402_Phycomp_RC0402.pdf; Author: CERN DEM JLC; CreateDate: 12/3/2007; LatestRevisionDate: 10/17/2012
R6 R32 = R0402_220R_1%_0.0625W_100PPM: Resistor - 1%; Part Description: General Purpose Thick Film Chip Resistor; Manufacturer: GENERIC; Manufacturer1 Part Number: 232270672201L; TC: ±100ppm/°C; PressFit: No; Part Number: R0402_220R_1%_0.0625W_100PPM; Component Kind: Standard; Component Type: Standard; Pin Count: 2; Value: 220; Status: Not Recommended; Power: 0.0625W; Manufacturer Part Number: R0402_220R_1%_0.0625W_100PPM; Case: 0402; Mounted: Yes; Sense: No; Socket: No; SMD: Yes; Manufacturer1 Example: YAGEO PHYCOMP; Manufacturer1 ComponentHeight: 0.4mm; HelpURL: \\cern.ch\dfs\Applications\Altium\Datasheets\R0402_Phycomp_RC0402.pdf; Author: CERN DEM JLC; CreateDate: 12/3/2007; LatestRevisionDate: 10/17/2012
R8 = R0402_180R_1%_0.0625W_100PPM: Resistor - 1%; Part Description: General Purpose Thick Film Chip Resistor; Manufacturer: GENERIC; Manufacturer1 Part Number: 232270671801L; TC: ±100ppm/°C; PressFit: No; Part Number: R0402_180R_1%_0.0625W_100PPM; Component Kind: Standard; Component Type: Standard; Pin Count: 2; Value: 180; Status: Not Recommended; Power: 0.0625W; Manufacturer Part Number: R0402_180R_1%_0.0625W_100PPM; Case: 0402; Mounted: Yes; Sense: No; Socket: No; SMD: Yes; Manufacturer1 Example: YAGEO PHYCOMP; Manufacturer1 ComponentHeight: 0.4mm; HelpURL: \\cern.ch\dfs\Applications\Altium\Datasheets\R0402_Phycomp_RC0402.pdf; Author: CERN DEM JLC; CreateDate: 12/3/2007; LatestRevisionDate: 10/17/2012
R10 R19 = R0402_560R_1%_0.0625W_100PPM: Resistor - 1%; Part Description: General Purpose Thick Film Chip Resistor; Manufacturer: GENERIC; Manufacturer1 Part Number: 232270675601L; TC: ±100ppm/°C; PressFit: No; Part Number: R0402_560R_1%_0.0625W_100PPM; Component Kind: Standard; Component Type: Standard; Pin Count: 2; Value: 560; Status: Not Recommended; Power: 0.0625W; Manufacturer Part Number: R0402_560R_1%_0.0625W_100PPM; Case: 0402; Mounted: Yes; Sense: No; Socket: No; SMD: Yes; Manufacturer1 Example: YAGEO PHYCOMP; Manufacturer1 ComponentHeight: 0.4mm; HelpURL: \\cern.ch\dfs\Applications\Altium\Datasheets\R0402_Phycomp_RC0402.pdf; Author: CERN DEM JLC; CreateDate: 12/3/2007; LatestRevisionDate: 10/17/2012
R11 R39 R41 R44 R57 R67 R72 = R0402_27R_1%_0.0625W_100PPM: Resistor - 1%; Part Description: General Purpose Thick Film Chip Resistor; Manufacturer: GENERIC; Manufacturer1 Part Number: 232270672709L; TC: ±100ppm/°C; PressFit: No; Part Number: R0402_27R_1%_0.0625W_100PPM; Component Kind: Standard; Component Type: Standard; Pin Count: 2; Value: 27; Status: Not Recommended; Power: 0.0625W; Manufacturer Part Number: R0402_27R_1%_0.0625W_100PPM; Case: 0402; Mounted: Yes; Sense: No; Socket: No; SMD: Yes; Manufacturer1 Example: YAGEO PHYCOMP; Manufacturer1 ComponentHeight: 0.4mm; HelpURL: \\cern.ch\dfs\Applications\Altium\Datasheets\R0402_Phycomp_RC0402.pdf; Author: CERN DEM JLC; CreateDate: 12/3/2007; LatestRevisionDate: 10/17/2012
R12 R42 R45 R51 = R0402_33R_1%_0.0625W_100PPM: Resistor - 1%; Part Description: General Purpose Thick Film Chip Resistor; Manufacturer: GENERIC; Manufacturer1 Part Number: 232270673309L; TC: ±100ppm/°C; PressFit: No; Part Number: R0402_33R_1%_0.0625W_100PPM; Component Kind: Standard; Component Type: Standard; Pin Count: 2; Value: 33; Status: Not Recommended; Power: 0.0625W; Manufacturer Part Number: R0402_33R_1%_0.0625W_100PPM; Case: 0402; Mounted: Yes; Sense: No; Socket: No; SMD: Yes; Manufacturer1 Example: YAGEO PHYCOMP; Manufacturer1 ComponentHeight: 0.4mm; HelpURL: \\cern.ch\dfs\Applications\Altium\Datasheets\R0402_Phycomp_RC0402.pdf; Author: CERN DEM JLC; CreateDate: 12/3/2007; LatestRevisionDate: 10/17/2012
R13 = R0402_15K_1%_0.0625W_100PPM: Resistor - 1%; Part Description: General Purpose Thick Film Chip Resistor; Manufacturer: GENERIC; Manufacturer1 Part Number: CRCW040215K0FK; TC: ±100ppm/°C; PressFit: No; Part Number: R0402_15K_1%_0.0625W_100PPM; Component Kind: Standard; Component Type: Standard; Pin Count: 2; Value: 15k; Status: Preferred; Power: 0.0625W; Manufacturer Part Number: R0402_15K_1%_0.0625W_100PPM; Case: 0402; Mounted: Yes; Sense: No; Socket: No; SMD: Yes; Manufacturer1 Example: VISHAY; Manufacturer1 ComponentHeight: 0.4mm; HelpURL: \\cern.ch\dfs\Applications\Altium\Datasheets\R0402_VISHAY_CRCW e3.pdf; Author: CERN DEM JMW; CreateDate: 7/6/2015; LatestRevisionDate: 7/6/2015
R14 R31 R46 R49 R50 R52 R54 R59 = R0402_100R_1%_0.0625W_100PPM: Resistor - 1%; Part Description: General Purpose Thick Film Chip Resistor; Manufacturer: GENERIC; Manufacturer1 Part Number: 232270671001L; TC: ±100ppm/°C; PressFit: No; Part Number: R0402_100R_1%_0.0625W_100PPM; Component Kind: Standard; Component Type: Standard; Pin Count: 2; Value: 100; Status: Not Recommended; Power: 0.0625W; Manufacturer Part Number: R0402_100R_1%_0.0625W_100PPM; Case: 0402; Mounted: Yes; Sense: No; Socket: No; SMD: Yes; Manufacturer1 Example: YAGEO PHYCOMP; Manufacturer1 ComponentHeight: 0.4mm; HelpURL: \\cern.ch\dfs\Applications\Altium\Datasheets\R0402_Phycomp_RC0402.pdf; Author: CERN DEM JLC; CreateDate: 12/3/2007; LatestRevisionDate: 10/17/2012
R16 = R0402_2K2_1%_0.0625W_100PPM: Resistor - 1%; Part Description: General Purpose Thick Film Chip Resistor; Manufacturer: GENERIC; Manufacturer1 Part Number: 232270672202L; TC: ±100ppm/°C; PressFit: No; Part Number: R0402_2K2_1%_0.0625W_100PPM; Component Kind: Standard; Component Type: Standard; Pin Count: 2; Value: 2k2; Status: Not Recommended; Power: 0.0625W; Manufacturer Part Number: R0402_2K2_1%_0.0625W_100PPM; Case: 0402; Mounted: Yes; Sense: No; Socket: No; SMD: Yes; Manufacturer1 Example: YAGEO PHYCOMP; Manufacturer1 ComponentHeight: 0.4mm; HelpURL: \\cern.ch\dfs\Applications\Altium\Datasheets\R0402_Phycomp_RC0402.pdf; Author: CERN DEM JLC; CreateDate: 12/3/2007; LatestRevisionDate: 10/17/2012
R20 = R0402_27K_1%_0.0625W_100PPM: Resistor - 1%; Part Description: General Purpose Thick Film Chip Resistor; Manufacturer: GENERIC; Manufacturer1 Part Number: 232270672703L; TC: ±100ppm/°C; PressFit: No; Part Number: R0402_27K_1%_0.0625W_100PPM; Component Kind: Standard; Component Type: Standard; Pin Count: 2; Value: 27k; Status: Not Recommended; Power: 0.0625W; Manufacturer Part Number: R0402_27K_1%_0.0625W_100PPM; Case: 0402; Mounted: Yes; Sense: No; Socket: No; SMD: Yes; Manufacturer1 Example: YAGEO PHYCOMP; Manufacturer1 ComponentHeight: 0.4mm; HelpURL: \\cern.ch\dfs\Applications\Altium\Datasheets\R0402_Phycomp_RC0402.pdf; Author: CERN DEM JLC; CreateDate: 12/3/2007; LatestRevisionDate: 10/17/2012
R21 R23 R38 = R0402_680R_1%_0.0625W_100PPM: Resistor - 1%; Part Description: General Purpose Thick Film Chip Resistor; Manufacturer: GENERIC; Manufacturer1 Part Number: 232270676801L; TC: ±100ppm/°C; PressFit: No; Part Number: R0402_680R_1%_0.0625W_100PPM; Component Kind: Standard; Component Type: Standard; Pin Count: 2; Value: 680; Status: Not Recommended; Power: 0.0625W; Manufacturer Part Number: R0402_680R_1%_0.0625W_100PPM; Case: 0402; Mounted: Yes; Sense: No; Socket: No; SMD: Yes; Manufacturer1 Example: YAGEO PHYCOMP; Manufacturer1 ComponentHeight: 0.4mm; HelpURL: \\cern.ch\dfs\Applications\Altium\Datasheets\R0402_Phycomp_RC0402.pdf; Author: CERN DEM JLC; CreateDate: 12/3/2007; LatestRevisionDate: 10/17/2012
R22 = R0402_200R_1%_0.0625W_100PPM: Resistor - 1%; Part Description: General Purpose Thick Film Chip Resistor; Manufacturer: GENERIC; Manufacturer1 Part Number: 232270672001L; TC: ±100ppm/°C; PressFit: No; Part Number: R0402_200R_1%_0.0625W_100PPM; Component Kind: Standard; Component Type: Standard; Pin Count: 2; Value: 200; Status: Not Recommended; Power: 0.0625W; Manufacturer Part Number: R0402_200R_1%_0.0625W_100PPM; Case: 0402; Mounted: Yes; Sense: No; Socket: No; SMD: Yes; Manufacturer1 Example: YAGEO PHYCOMP; Manufacturer1 ComponentHeight: 0.4mm; HelpURL: \\cern.ch\dfs\Applications\Altium\Datasheets\R0402_Phycomp_RC0402.pdf; Author: CERN DEM JLC; CreateDate: 12/3/2007; LatestRevisionDate: 10/17/2012
R24 = R0402_160R_1%_0.0625W_100PPM: Resistor - 1%; Part Description: General Purpose Thick Film Chip Resistor; Manufacturer: GENERIC; Manufacturer1 Part Number: 232270671601L; TC: ±100ppm/°C; PressFit: No; Part Number: R0402_160R_1%_0.0625W_100PPM; Component Kind: Standard; Component Type: Standard; Pin Count: 2; Value: 160; Status: Not Recommended; Power: 0.0625W; Manufacturer Part Number: R0402_160R_1%_0.0625W_100PPM; Case: 0402; Mounted: Yes; Sense: No; Socket: No; SMD: Yes; Manufacturer1 Example: YAGEO PHYCOMP; Manufacturer1 ComponentHeight: 0.4mm; HelpURL: \\cern.ch\dfs\Applications\Altium\Datasheets\R0402_Phycomp_RC0402.pdf; Author: CERN DEM JLC; CreateDate: 12/3/2007; LatestRevisionDate: 10/17/2012
R33 R40 = R0402_68R_1%_0.0625W_100PPM: Resistor - 1%; Part Description: General Purpose Thick Film Chip Resistor; Manufacturer: GENERIC; Manufacturer1 Part Number: 232270676809L; TC: ±100ppm/°C; PressFit: No; Part Number: R0402_68R_1%_0.0625W_100PPM; Component Kind: Standard; Component Type: Standard; Pin Count: 2; Value: 68; Status: Not Recommended; Power: 0.0625W; Manufacturer Part Number: R0402_68R_1%_0.0625W_100PPM; Case: 0402; Mounted: Yes; Sense: No; Socket: No; SMD: Yes; Manufacturer1 Example: YAGEO PHYCOMP; Manufacturer1 ComponentHeight: 0.4mm; HelpURL: \\cern.ch\dfs\Applications\Altium\Datasheets\R0402_Phycomp_RC0402.pdf; Author: CERN DEM JLC; CreateDate: 12/3/2007; LatestRevisionDate: 10/17/2012
R35 = R0805_22R_1%_0.125W_100PPM: Resistor - 1%; Part Description: General Purpose Thick Film Chip Resistor; Manufacturer: GENERIC; Manufacturer1 Part Number: NRC10F22R0TRF; Power: 0.125W; TC: ±100ppm/°C; PressFit: No; Part Number: R0805_22R_1%_0.125W_100PPM; Component Kind: Standard; Component Type: Standard; Pin Count: 2; Value: 22; Status: Preferred; Manufacturer Part Number: R0805_22R_1%_0.125W_100PPM; Case: 0805; Mounted: Yes; Sense: No; Socket: No; SMD: Yes; Manufacturer1 Example: NIC COMPONENT; Manufacturer1 ComponentHeight: 0.6mm; HelpURL: \\cern.ch\dfs\Applications\Altium\Datasheets\R0805_NIC_NRC.pdf; Author: CERN DEM JLC; CreateDate: 12/3/2007; LatestRevisionDate: 3/13/2008
R36 R68 = R0402_820R_1%_0.0625W_100PPM: Resistor - 1%; Part Description: General Purpose Thick Film Chip Resistor; Manufacturer: GENERIC; Manufacturer1 Part Number: 232270678201L; TC: ±100ppm/°C; PressFit: No; Part Number: R0402_820R_1%_0.0625W_100PPM; Component Kind: Standard; Component Type: Standard; Pin Count: 2; Value: 820; Status: Not Recommended; Power: 0.0625W; Manufacturer Part Number: R0402_820R_1%_0.0625W_100PPM; Case: 0402; Mounted: Yes; Sense: No; Socket: No; SMD: Yes; Manufacturer1 Example: YAGEO PHYCOMP; Manufacturer1 ComponentHeight: 0.4mm; HelpURL: \\cern.ch\dfs\Applications\Altium\Datasheets\R0402_Phycomp_RC0402.pdf; Author: CERN DEM JLC; CreateDate: 12/3/2007; LatestRevisionDate: 10/17/2012
R47 = R0402_130R_1%_0.0625W_100PPM: Resistor - 1%; Part Description: General Purpose Thick Film Chip Resistor; Manufacturer: GENERIC; Manufacturer1 Part Number: 232270671301L; TC: ±100ppm/°C; PressFit: No; Part Number: R0402_130R_1%_0.0625W_100PPM; Component Kind: Standard; Component Type: Standard; Pin Count: 2; Value: 130; Status: Not Recommended; Power: 0.0625W; Manufacturer Part Number: R0402_130R_1%_0.0625W_100PPM; Case: 0402; Mounted: Yes; Sense: No; Socket: No; SMD: Yes; Manufacturer1 Example: YAGEO PHYCOMP; Manufacturer1 ComponentHeight: 0.4mm; HelpURL: \\cern.ch\dfs\Applications\Altium\Datasheets\R0402_Phycomp_RC0402.pdf; Author: CERN DEM JLC; CreateDate: 12/3/2007; LatestRevisionDate: 10/17/2012
R55 = R0402_20R_1%_0.0625W_100PPM: Resistor - 1%; Part Description: General Purpose Thick Film Chip Resistor; Manufacturer: GENERIC; Manufacturer1 Part Number: 232270672009L; TC: ±100ppm/°C; PressFit: No; Part Number: R0402_20R_1%_0.0625W_100PPM; Component Kind: Standard; Component Type: Standard; Pin Count: 2; Value: 20; Status: Not Recommended; Power: 0.0625W; Manufacturer Part Number: R0402_20R_1%_0.0625W_100PPM; Case: 0402; Mounted: Yes; Sense: No; Socket: No; SMD: Yes; Manufacturer1 Example: YAGEO PHYCOMP; Manufacturer1 ComponentHeight: 0.4mm; HelpURL: \\cern.ch\dfs\Applications\Altium\Datasheets\R0402_Phycomp_RC0402.pdf; Author: CERN DEM JLC; CreateDate: 12/3/2007; LatestRevisionDate: 10/17/2012
R58 = R0402_10K_1%_0.0625W_100PPM: Resistor - 1%; Part Description: General Purpose Thick Film Chip Resistor; Manufacturer: GENERIC; Manufacturer1 Part Number: 232270671003L; TC: ±100ppm/°C; PressFit: No; Part Number: R0402_10K_1%_0.0625W_100PPM; Component Kind: Standard; Component Type: Standard; Pin Count: 2; Value: 10k; Status: Not Recommended; Power: 0.0625W; Manufacturer Part Number: R0402_10K_1%_0.0625W_100PPM; Case: 0402; Mounted: Yes; Sense: No; Socket: No; SMD: Yes; Manufacturer1 Example: YAGEO PHYCOMP; Manufacturer1 ComponentHeight: 0.4mm; HelpURL: \\cern.ch\dfs\Applications\Altium\Datasheets\R0402_Phycomp_RC0402.pdf; Author: CERN DEM JLC; CreateDate: 12/3/2007; LatestRevisionDate: 10/17/2012
R70 R71 R73 R74 = R0402_1K_1%_0.0625W_100PPM: Resistor - 1%; Part Description: General Purpose Thick Film Chip Resistor; Manufacturer: GENERIC; Manufacturer1 Part Number: 232270671002L; TC: ±100ppm/°C; PressFit: No; Part Number: R0402_1K_1%_0.0625W_100PPM; Component Kind: Standard; Component Type: Standard; Pin Count: 2; Value: 1k; Status: Not Recommended; Power: 0.0625W; Manufacturer Part Number: R0402_1K_1%_0.0625W_100PPM; Case: 0402; Mounted: Yes; Sense: No; Socket: No; SMD: Yes; Manufacturer1 Example: YAGEO PHYCOMP; Manufacturer1 ComponentHeight: 0.4mm; HelpURL: \\cern.ch\dfs\Applications\Altium\Datasheets\R0402_Phycomp_RC0402.pdf; Author: CERN DEM JLC; CreateDate: 12/3/2007; LatestRevisionDate: 10/17/2012
R224 = R0805_27R_1%_0.125W_100PPM: Resistor - 1%; Part Description: General Purpose Thick Film Chip Resistor; Manufacturer: GENERIC; Manufacturer1 Part Number: NRC10F27R0TRF; Power: 0.125W; TC: ±100ppm/°C; PressFit: No; Part Number: R0805_27R_1%_0.125W_100PPM; Component Kind: Standard; Component Type: Standard; Pin Count: 2; Value: 27; Status: Preferred; Manufacturer Part Number: R0805_27R_1%_0.125W_100PPM; Case: 0805; Mounted: Yes; Sense: No; Socket: No; SMD: Yes; Manufacturer1 Example: NIC COMPONENT; Manufacturer1 ComponentHeight: 0.6mm; HelpURL: \\cern.ch\dfs\Applications\Altium\Datasheets\R0805_NIC_NRC.pdf; Author: CERN DEM JLC; CreateDate: 12/3/2007; LatestRevisionDate: 3/13/2008